# EAGLE board board (EAGLE 6.5.0), part 1 of 2
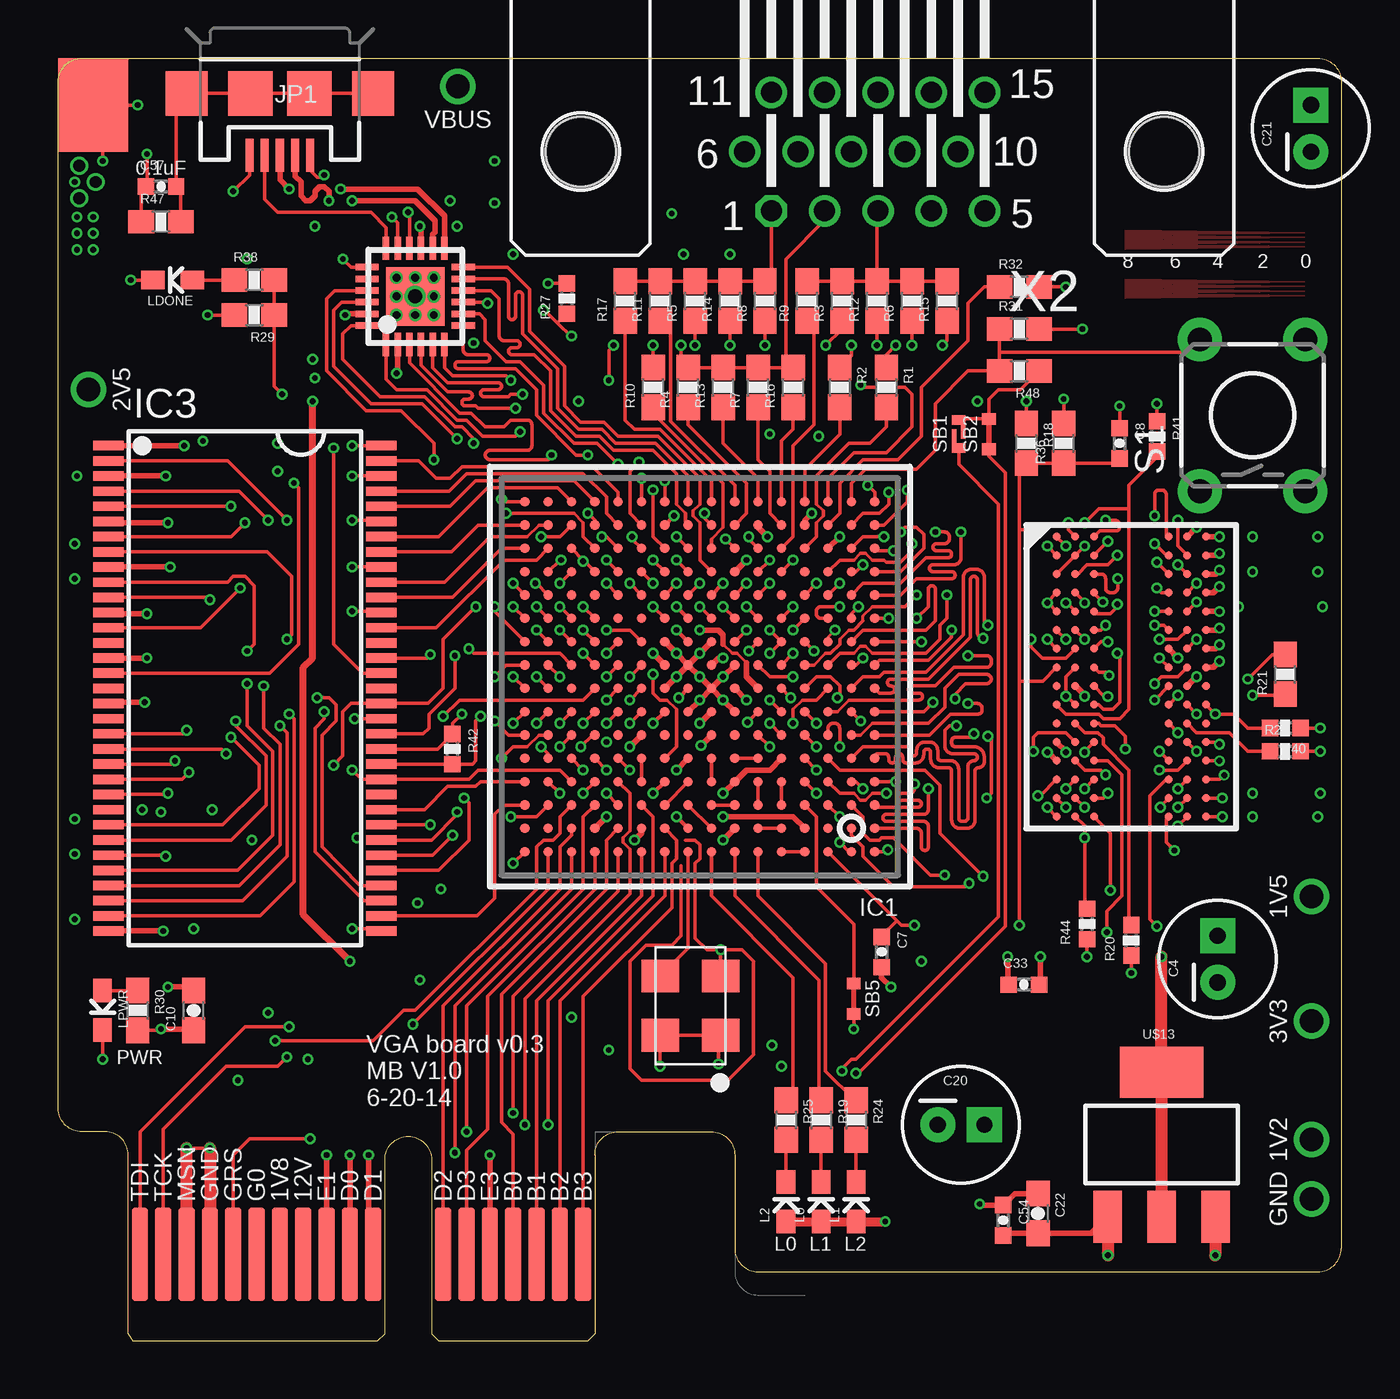
[diagram p2: board, top side]
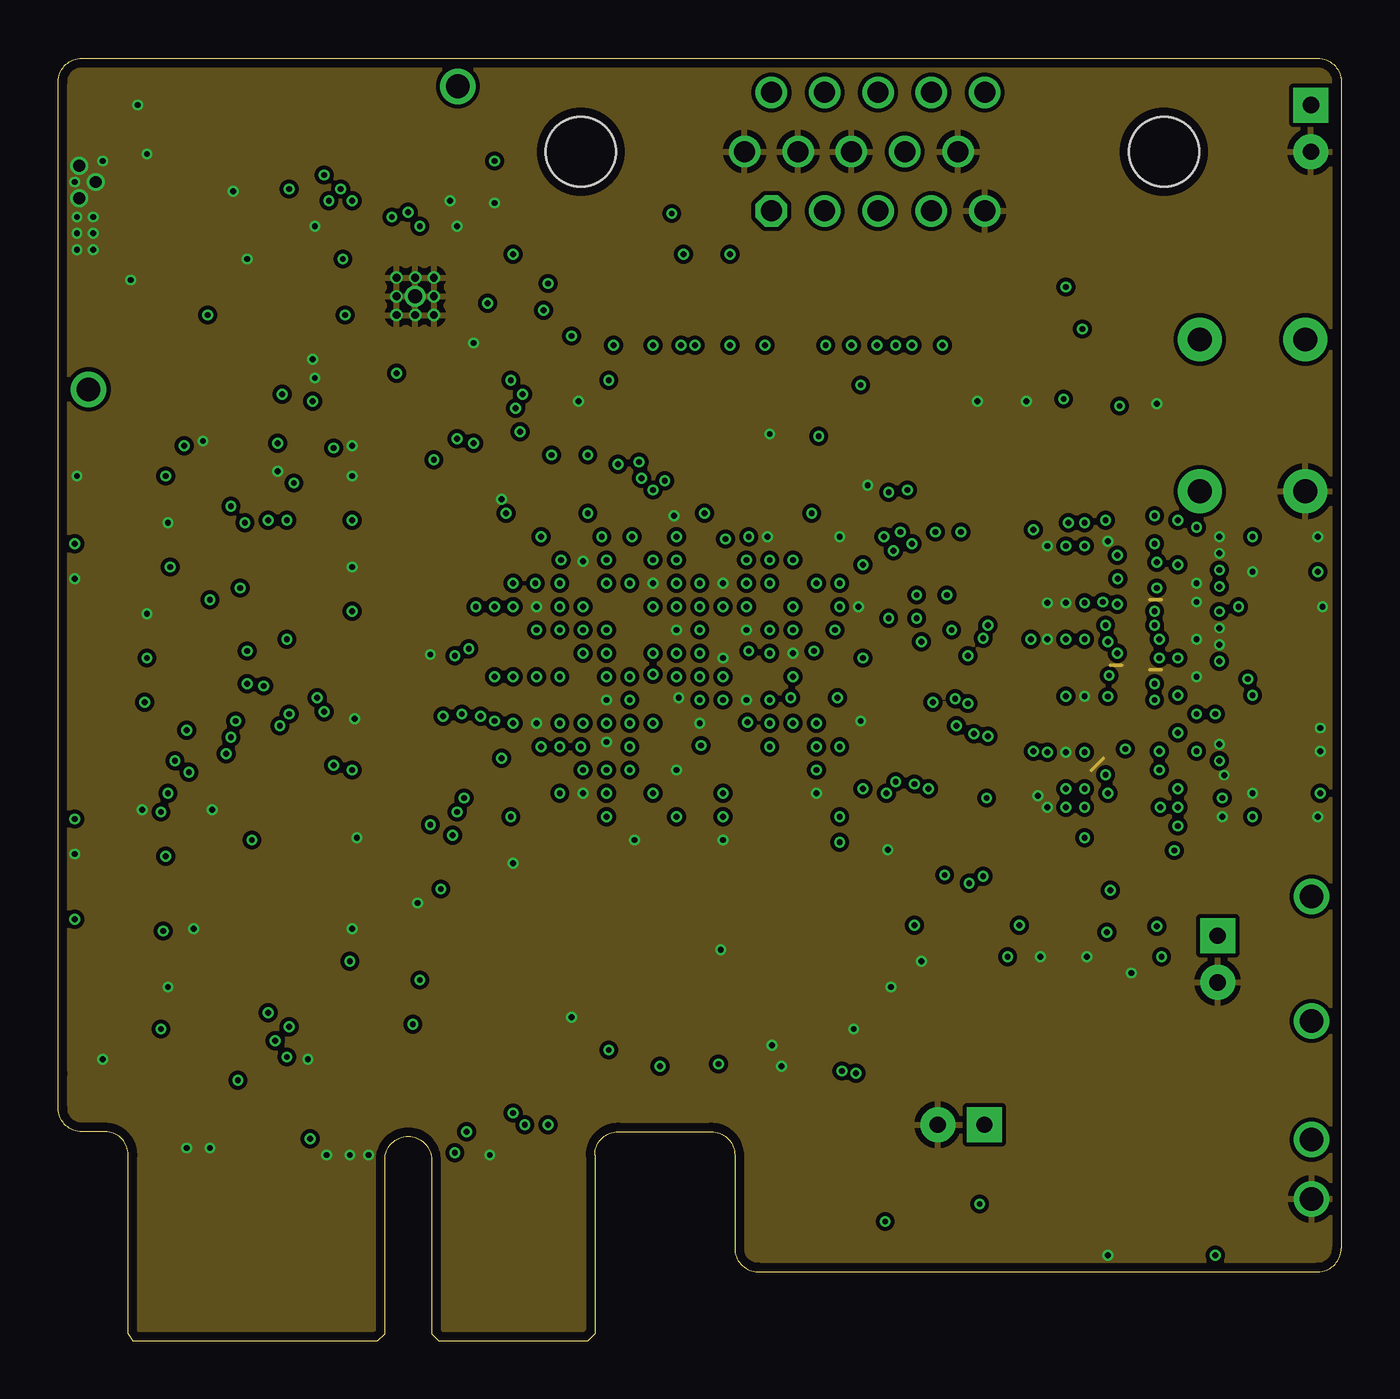
[diagram p3: board, inner layer Route2]
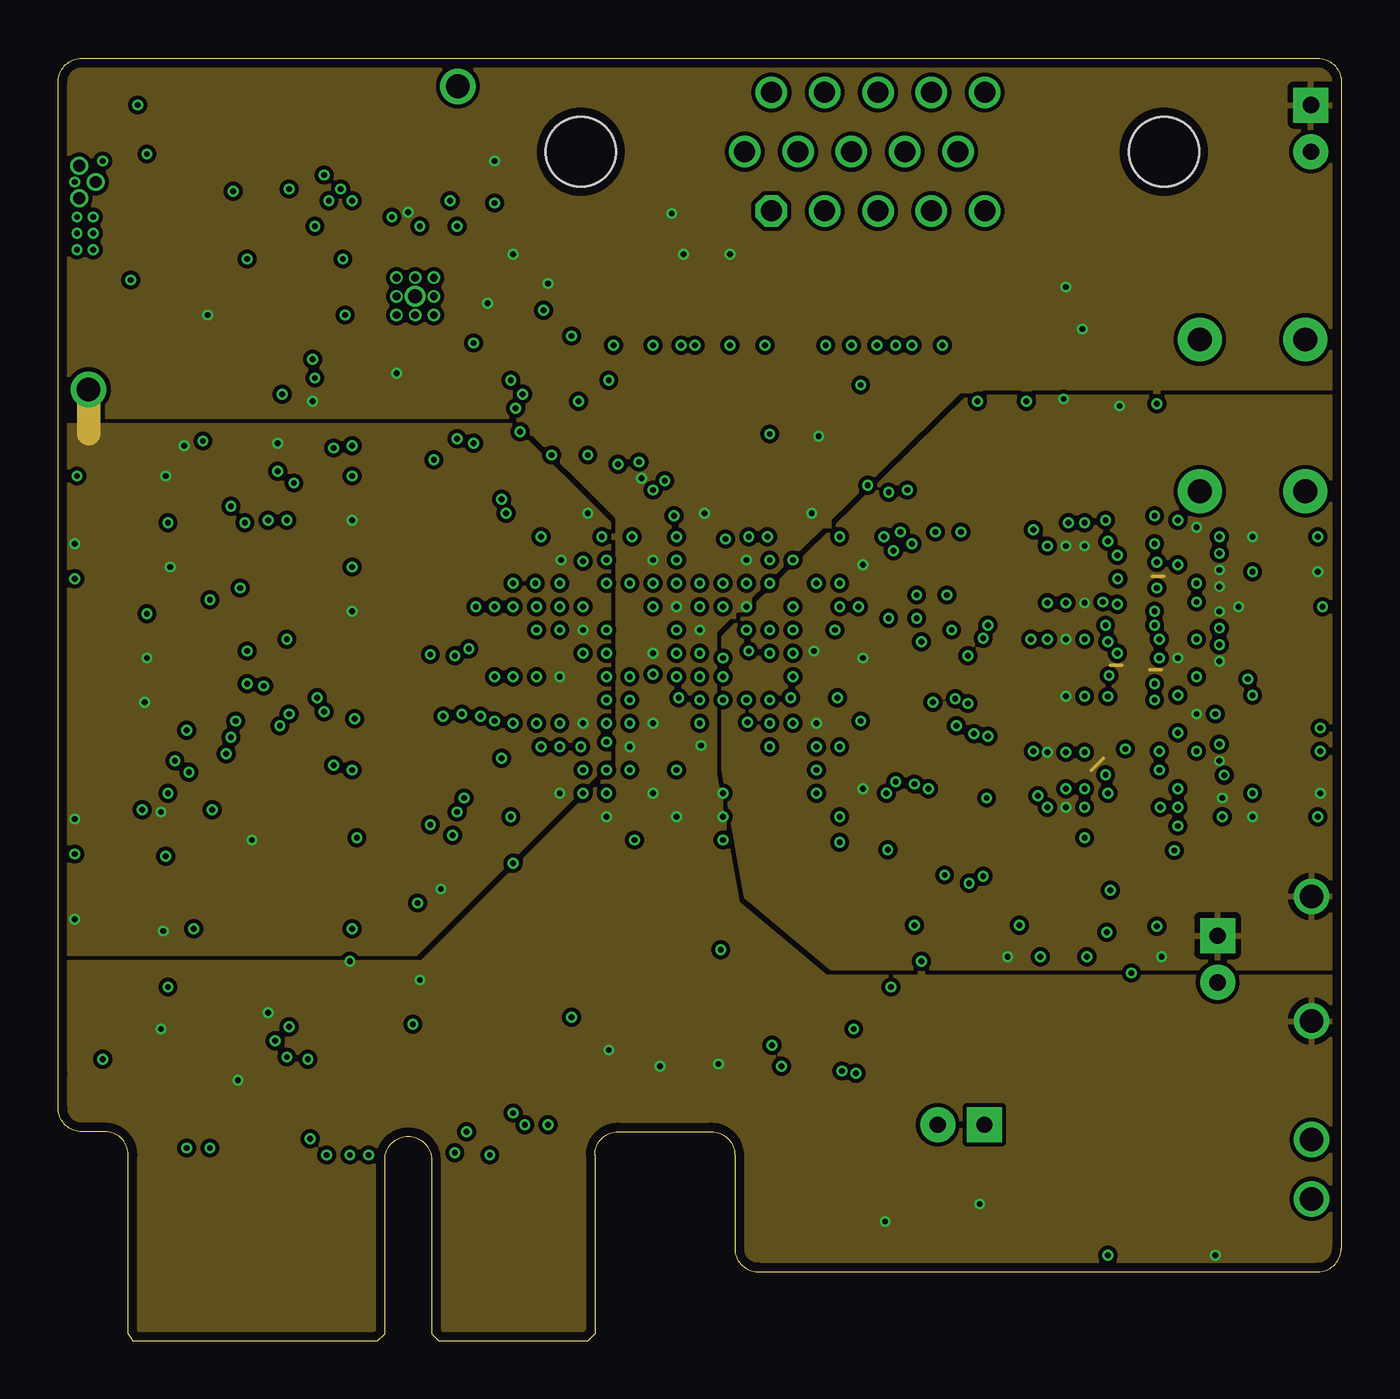
[diagram p4: board, inner layer Route15]
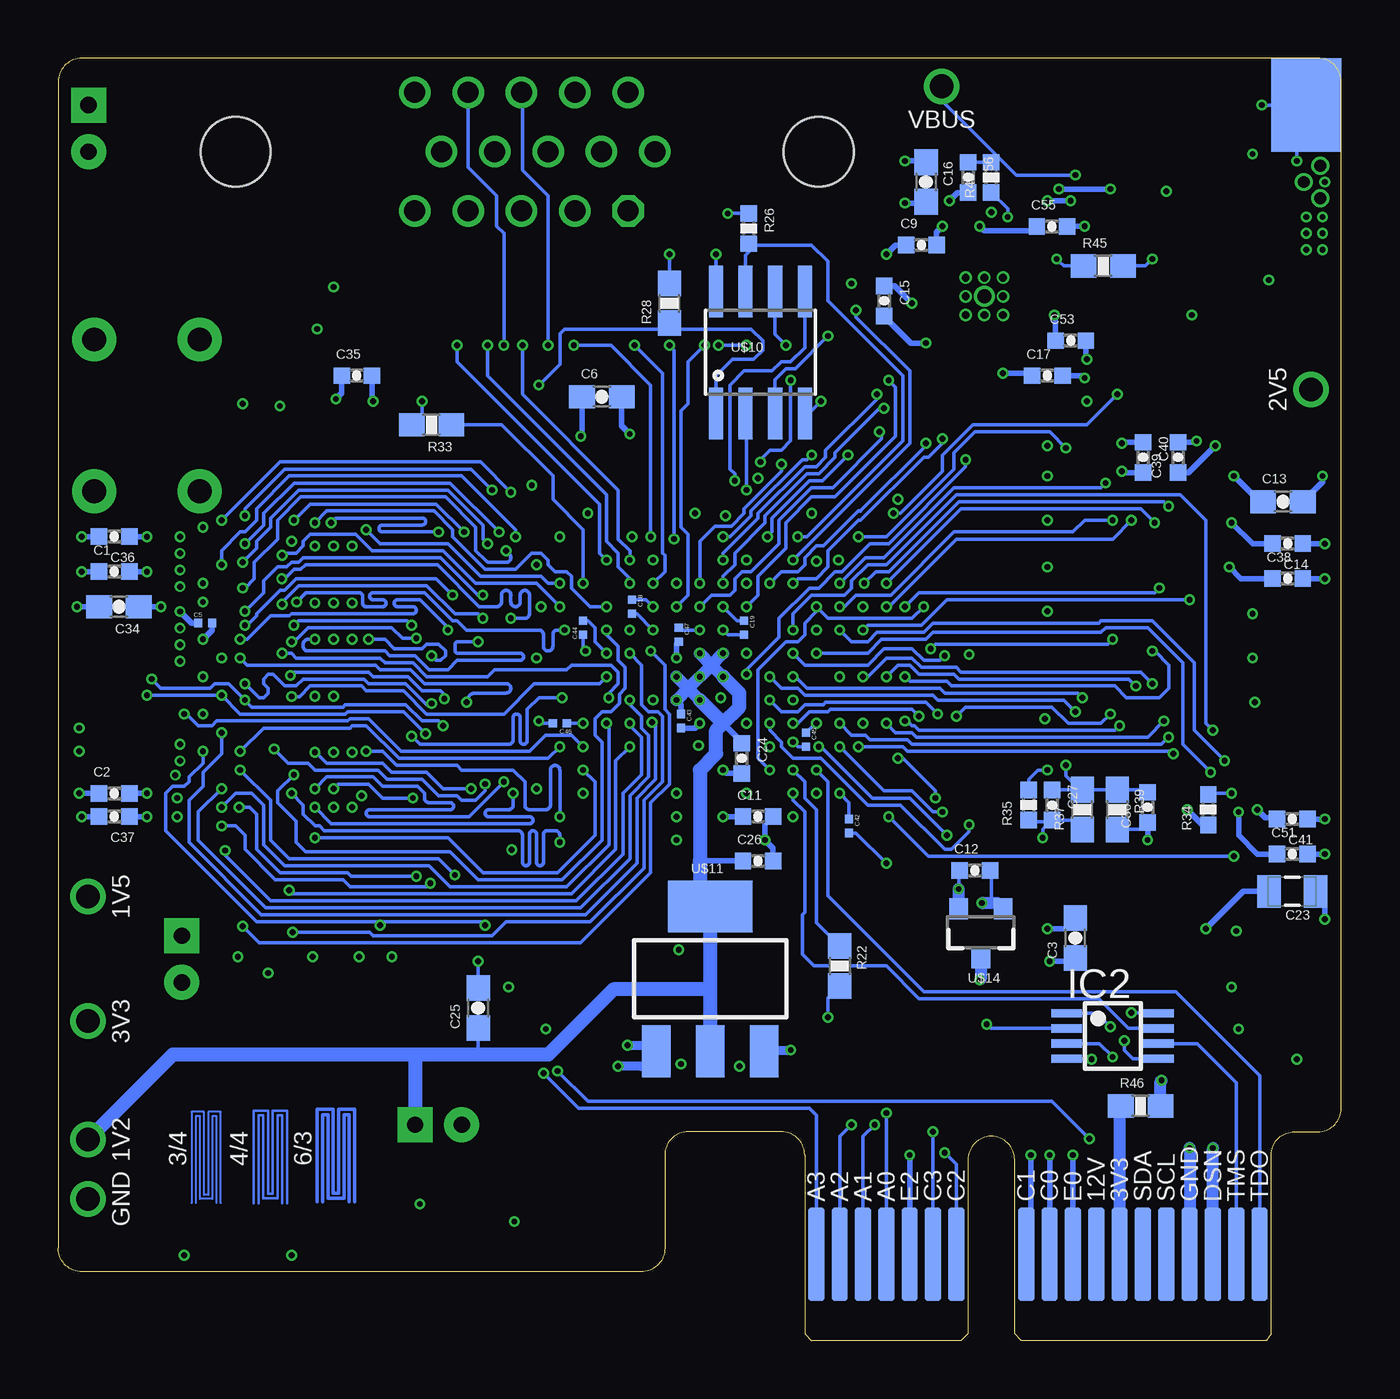
[diagram p5: board, bottom side, seen from below]

Size 55 x 54.95 mm. Coordinates in mm from the lower left corner, seen from the top.
Outline: 0,11.45 0,53.95 arc-90 1,54.95 54,54.95 arc-90 55,53.95 55,3.95 arc-90 54,2.95 30,2.95 arc-90 29,3.95 29,7.95 arc90 28,8.95 24,8.95 arc90 23,7.95
Copper layers (1+2*15+16): Top 0.0356mm / dielectric 0.17mm / Route2 0.0178mm / dielectric 1.1941mm / Route15 0.0178mm / dielectric 0.17mm / Bottom 0.0356mm
Design rules "OSHPark_mine_4layer *": minimum track width 5mil, minimum drill 10mil, track to track 5mil, track to pad 5mil, pad to pad 5mil, via to via 5mil, smd to smd 5mil, copper to edge 15mil, drill to drill 6mil, minimum pad ring 4mil, minimum via ring 4mil, stop-mask expansion 2mil, vias tented up to drill 13mil, thermal gap 10mil

## Footprints (pad centres in the part's own frame; a part is rotated, then mirrored left to right if it is on the bottom)
0402-CAP = smd 0.7 x 0.7: 1 -0.65,0; 2 0.65,0
0603-CAP = smd 1.1 x 1: 1 -0.85,0; 2 0.85,0
CAP-5-2 = drill 0.7 pad 1.5 square: 1 1,0 | drill 0.7 pad 1.5: 2 -1,0
C0201 = smd 0.35 x 0.35: 1 -0.3,0; 2 0.3,0
0805 = smd 1 x 1.4: 1 -1,0; 2 1,0
CLIP-AREA = smd 4 x 3: P$1 0,0 | smd 4 x 3 bottom: P$2 0,0
HOLE_22AWG = drill 1.016: P 0,0
BGA96 = smd 0.35 x 0.35: A1 -3.2,6; A2 -2.4,6; A3 -1.6,6; A7 1.6,6; A8 2.4,6; A9 3.2,6; B1 -3.2,5.2; B2 -2.4,5.2; B3 -1.6,5.2; B7 1.6,5.2; B8 2.4,5.2; B9 3.2,5.2; C1 -3.2,4.4; C2 -2.4,4.4; C3 -1.6,4.4; C7 1.6,4.4; C8 2.4,4.4; C9 3.2,4.4; D1 -3.2,3.6; D2 -2.4,3.6; D3 -1.6,3.6; D7 1.6,3.6; D8 2.4,3.6; D9 3.2,3.6; E1 -3.2,2.8; E2 -2.4,2.8; E3 -1.6,2.8; E7 1.6,2.8; E8 2.4,2.8; E9 3.2,2.8; F1 -3.2,2; F2 -2.4,2; F3 -1.6,2; F7 1.6,2; F8 2.4,2; F9 3.2,2; G1 -3.2,1.2; G2 -2.4,1.2; G3 -1.6,1.2; G7 1.6,1.2; G8 2.4,1.2; G9 3.2,1.2; H1 -3.2,0.4; H2 -2.4,0.4; H3 -1.6,0.4; H7 1.6,0.4; H8 2.4,0.4; H9 3.2,0.4; J1 -3.2,-0.4; J2 -2.4,-0.4; J3 -1.6,-0.4; J7 1.6,-0.4; J8 2.4,-0.4; J9 3.2,-0.4; K1 -3.2,-1.2; K2 -2.4,-1.2; K3 -1.6,-1.2; K7 1.6,-1.2; K8 2.4,-1.2; K9 3.2,-1.2; L1 -3.2,-2; L2 -2.4,-2; L3 -1.6,-2; L7 1.6,-2; L8 2.4,-2; L9 3.2,-2; M1 -3.2,-2.8; M2 -2.4,-2.8; M3 -1.6,-2.8; M7 1.6,-2.8; M8 2.4,-2.8; M9 3.2,-2.8; N1 -3.2,-3.6; N2 -2.4,-3.6; N3 -1.6,-3.6; N7 1.6,-3.6; N8 2.4,-3.6; N9 3.2,-3.6; P1 -3.2,-4.4; P2 -2.4,-4.4; P3 -1.6,-4.4; P7 1.6,-4.4; P8 2.4,-4.4; P9 3.2,-4.4; R1 -3.2,-5.2; R2 -2.4,-5.2; R3 -1.6,-5.2; R7 1.6,-5.2; R8 2.4,-5.2; R9 3.2,-5.2; T1 -3.2,-6; T2 -2.4,-6; T3 -1.6,-6; T7 1.6,-6; T8 2.4,-6; T9 3.2,-6
XILINX_FT256 = smd 0.4 x 0.4: A1 -7.5,7.5; A2 -6.5,7.5; A3 -5.5,7.5; A4 -4.5,7.5; A5 -3.5,7.5; A6 -2.5,7.5; A7 -1.5,7.5; A8 -0.5,7.5; A9 0.5,7.5; A10 1.5,7.5; A11 2.5,7.5; A12 3.5,7.5; A13 4.5,7.5; A14 5.5,7.5; A15 6.5,7.5; A16 7.5,7.5; B1 -7.5,6.5; B2 -6.5,6.5; B3 -5.5,6.5; B4 -4.5,6.5; B5 -3.5,6.5; B6 -2.5,6.5; B7 -1.5,6.5; B8 -0.5,6.5; B9 0.5,6.5; B10 1.5,6.5; B11 2.5,6.5; B12 3.5,6.5; B13 4.5,6.5; B14 5.5,6.5; B15 6.5,6.5; B16 7.5,6.5; C1 -7.5,5.5; C2 -6.5,5.5; C3 -5.5,5.5; C4 -4.5,5.5; C5 -3.5,5.5; C6 -2.5,5.5; C7 -1.5,5.5; C8 -0.5,5.5; C9 0.5,5.5; C10 1.5,5.5; C11 2.5,5.5; C12 3.5,5.5; C13 4.5,5.5; C14 5.5,5.5; C15 6.5,5.5; C16 7.5,5.5; D1 -7.5,4.5; D2 -6.5,4.5; D3 -5.5,4.5; D4 -4.5,4.5; D5 -3.5,4.5; D6 -2.5,4.5; D7 -1.5,4.5; D8 -0.5,4.5; D9 0.5,4.5; D10 1.5,4.5; D11 2.5,4.5; D12 3.5,4.5; D13 4.5,4.5; D14 5.5,4.5; D15 6.5,4.5; D16 7.5,4.5; E1 -7.5,3.5; E2 -6.5,3.5; E3 -5.5,3.5; E4 -4.5,3.5; E5 -3.5,3.5; E6 -2.5,3.5; E7 -1.5,3.5; E8 -0.5,3.5; E9 0.5,3.5; E10 1.5,3.5; E11 2.5,3.5; E12 3.5,3.5; E13 4.5,3.5; E14 5.5,3.5; E15 6.5,3.5; E16 7.5,3.5; F1 -7.5,2.5; F2 -6.5,2.5; F3 -5.5,2.5; F4 -4.5,2.5; F5 -3.5,2.5; F6 -2.5,2.5; F7 -1.5,2.5; F8 -0.5,2.5; F9 0.5,2.5; F10 1.5,2.5; F11 2.5,2.5; F12 3.5,2.5; F13 4.5,2.5; F14 5.5,2.5; F15 6.5,2.5; F16 7.5,2.5; G1 -7.5,1.5; G2 -6.5,1.5; G3 -5.5,1.5; G4 -4.5,1.5; G5 -3.5,1.5; G6 -2.5,1.5; G7 -1.5,1.5; G8 -0.5,1.5; G9 0.5,1.5; G10 1.5,1.5; G11 2.5,1.5; G12 3.5,1.5; G13 4.5,1.5; G14 5.5,1.5; G15 6.5,1.5; G16 7.5,1.5; H1 -7.5,0.5; H2 -6.5,0.5; H3 -5.5,0.5; H4 -4.5,0.5; H5 -3.5,0.5; H6 -2.5,0.5; H7 -1.5,0.5; H8 -0.5,0.5; H9 0.5,0.5; H10 1.5,0.5; H11 2.5,0.5; H12 3.5,0.5; H13 4.5,0.5; H14 5.5,0.5; H15 6.5,0.5; H16 7.5,0.5; J1 -7.5,-0.5; J2 -6.5,-0.5; J3 -5.5,-0.5; J4 -4.5,-0.5; J5 -3.5,-0.5; J6 -2.5,-0.5; J7 -1.5,-0.5; J8 -0.5,-0.5; J9 0.5,-0.5; J10 1.5,-0.5; J11 2.5,-0.5; J12 3.5,-0.5; J13 4.5,-0.5; J14 5.5,-0.5; J15 6.5,-0.5; J16 7.5,-0.5; K1 -7.5,-1.5; K2 -6.5,-1.5; K3 -5.5,-1.5; K4 -4.5,-1.5; K5 -3.5,-1.5; K6 -2.5,-1.5; K7 -1.5,-1.5; K8 -0.5,-1.5; K9 0.5,-1.5; K10 1.5,-1.5; K11 2.5,-1.5; K12 3.5,-1.5; K13 4.5,-1.5; K14 5.5,-1.5; K15 6.5,-1.5; K16 7.5,-1.5; L1 -7.5,-2.5; L2 -6.5,-2.5; L3 -5.5,-2.5; L4 -4.5,-2.5; L5 -3.5,-2.5; L6 -2.5,-2.5; L7 -1.5,-2.5; L8 -0.5,-2.5; L9 0.5,-2.5; L10 1.5,-2.5; L11 2.5,-2.5; L12 3.5,-2.5; L13 4.5,-2.5; L14 5.5,-2.5; L15 6.5,-2.5; L16 7.5,-2.5; M1 -7.5,-3.5; M2 -6.5,-3.5; M3 -5.5,-3.5; M4 -4.5,-3.5; M5 -3.5,-3.5; M6 -2.5,-3.5; M7 -1.5,-3.5; M8 -0.5,-3.5; M9 0.5,-3.5; M10 1.5,-3.5; M11 2.5,-3.5; M12 3.5,-3.5; M13 4.5,-3.5; M14 5.5,-3.5; M15 6.5,-3.5; M16 7.5,-3.5; N1 -7.5,-4.5; N2 -6.5,-4.5; N3 -5.5,-4.5; N4 -4.5,-4.5; N5 -3.5,-4.5; N6 -2.5,-4.5; N7 -1.5,-4.5; N8 -0.5,-4.5; N9 0.5,-4.5; N10 1.5,-4.5; N11 2.5,-4.5; N12 3.5,-4.5; N13 4.5,-4.5; N14 5.5,-4.5; N15 6.5,-4.5; N16 7.5,-4.5; P1 -7.5,-5.5; P2 -6.5,-5.5; P3 -5.5,-5.5; P4 -4.5,-5.5; P5 -3.5,-5.5; P6 -2.5,-5.5; P7 -1.5,-5.5; P8 -0.5,-5.5; P9 0.5,-5.5; P10 1.5,-5.5; P11 2.5,-5.5; P12 3.5,-5.5; P13 4.5,-5.5; P14 5.5,-5.5; P15 6.5,-5.5; P16 7.5,-5.5; R1 -7.5,-6.5; R2 -6.5,-6.5; R3 -5.5,-6.5; R4 -4.5,-6.5; R5 -3.5,-6.5; R6 -2.5,-6.5; R7 -1.5,-6.5; R8 -0.5,-6.5; R9 0.5,-6.5; R10 1.5,-6.5; R11 2.5,-6.5; R12 3.5,-6.5; R13 4.5,-6.5; R14 5.5,-6.5; R15 6.5,-6.5; R16 7.5,-6.5; T1 -7.5,-7.5; T2 -6.5,-7.5; T3 -5.5,-7.5; T4 -4.5,-7.5; T5 -3.5,-7.5; T6 -2.5,-7.5; T7 -1.5,-7.5; T8 -0.5,-7.5; T9 0.5,-7.5; T10 1.5,-7.5; T11 2.5,-7.5; T12 3.5,-7.5; T13 4.5,-7.5; T14 5.5,-7.5; T15 6.5,-7.5; T16 7.5,-7.5
TSSOP8 = smd 1.3 x 0.35: 1 -1.975,0.975; 2 -1.975,0.325; 3 -1.975,-0.325; 4 -1.975,-0.975; 5 1.975,-0.975; 6 1.975,-0.325; 7 1.975,0.325; 8 1.975,0.975
TSOP66-400 = smd 0.4 x 1.3: 1 -10.4,-5.85; 2 -9.75,-5.85; 3 -9.1,-5.85; 4 -8.45,-5.85; 5 -7.8,-5.85; 6 -7.15,-5.85; 7 -6.5,-5.85; 8 -5.85,-5.85; 9 -5.2,-5.85; 10 -4.55,-5.85; 11 -3.9,-5.85; 12 -3.25,-5.85; 13 -2.6,-5.85; 14 -1.95,-5.85; 15 -1.3,-5.85; 16 -0.65,-5.85; 17 0,-5.85; 18 0.65,-5.85; 19 1.3,-5.85; 20 1.95,-5.85; 21 2.6,-5.85; 22 3.25,-5.85; 23 3.9,-5.85; 24 4.55,-5.85; 25 5.2,-5.85; 26 5.85,-5.85; 27 6.5,-5.85; 28 7.15,-5.85; 29 7.8,-5.85; 30 8.45,-5.85; 31 9.1,-5.85; 32 9.75,-5.85; 33 10.4,-5.85; 34 10.4,5.85; 35 9.75,5.85; 36 9.1,5.85; 37 8.45,5.85; 38 7.8,5.85; 39 7.15,5.85; 40 6.5,5.85; 41 5.85,5.85; 42 5.2,5.85; 43 4.55,5.85; 44 3.9,5.85; 45 3.25,5.85; 46 2.6,5.85; 47 1.95,5.85; 48 1.3,5.85; 49 0.65,5.85; 50 0,5.85; 51 -0.65,5.85; 52 -1.3,5.85; 53 -1.95,5.85; 54 -2.6,5.85; 55 -3.25,5.85; 56 -3.9,5.85; 57 -4.55,5.85; 58 -5.2,5.85; 59 -5.85,5.85; 60 -6.5,5.85; 61 -7.15,5.85; 62 -7.8,5.85; 63 -8.45,5.85; 64 -9.1,5.85; 65 -9.75,5.85; 66 -10.4,5.85
USB-MICRO = smd 0.35 x 1.4: D+ 0,2.65; D- -0.65,2.65; GND 1.3,2.65; ID 0.65,2.65; VBUS -1.3,2.65 | smd 1.8 x 1.9: MT1 -4,0; MT2 4,0 | smd 1.9 x 1.9: P$1 -1.27,0; P$2 1.27,0
0603_LED = smd 0.8 x 1.003: A 0,-0.852; C 0,0.852
0603-RES = smd 1.1 x 1: 1 -0.85,0; 2 0.85,0
0402-RES = smd 0.7 x 0.7: 1 -0.65,0; 2 0.65,0
TACTILE-PTH = drill 1.016 pad 1.88: 1 -3.251,2.261; 2 3.251,2.261; 3 -3.251,-2.261; 4 3.251,-2.261
SOLDER-BRIDGE-OPEN = smd 0.4 x 0.6: L1 -0.6,0; R1 0.6,0 | smd 0.6 x 0.2: L2 -0.1,0.2; R2 0.1,-0.2
TRACE-CUT = smd 0.5 x 0.6: L1 -0.65,0; R1 0.65,0
MB-V1-X1-EDGE = smd 0.7 x 4 bottom: A1 -11.5,-0.75; A2 -10.5,-0.75; A3 -9.5,-0.75; A4 -8.5,-0.75; A5 -7.5,-0.75; A6 -6.5,-0.75; A7 -5.5,-0.75; A8 -4.5,-0.75; A9 -3.5,-0.75; A10 -2.5,-0.75; A11 -1.5,-0.75; A12 1.5,-0.75; A13 2.5,-0.75; A14 3.5,-0.75; A15 4.5,-0.75; A16 5.5,-0.75; A17 6.5,-0.75; A18 7.5,-0.75 | smd 0.7 x 4: B1 -11.5,-0.75; B2 -10.5,-0.75; B3 -9.5,-0.75; B4 -8.5,-0.75; B5 -7.5,-0.75; B6 -6.5,-0.75; B7 -5.5,-0.75; B8 -4.5,-0.75; B9 -3.5,-0.75; B10 -2.5,-0.75; B11 -1.5,-0.75; B12 1.5,-0.75; B13 2.5,-0.75; B14 3.5,-0.75; B15 4.5,-0.75; B16 5.5,-0.75; B17 6.5,-0.75; B18 7.5,-0.75
CTS-636 = smd 1.4 x 1.6: 1 -1.27,-1.3; 2 1.27,-1.3; 3 1.27,1.3; 4 -1.27,1.3
SO08 = smd 0.61 x 2.21: 1 -1.905,-2.616; 2 -0.635,-2.616; 3 0.635,-2.616; 4 1.905,-2.616; 5 1.905,2.616; 6 0.635,2.616; 7 -0.635,2.616; 8 -1.905,2.616
SOT223 = smd 1.219 x 2.235: 1 -2.311,-3.099; 2 0,-3.099; 3 2.311,-3.099 | smd 3.6 x 2.2: 4 0,3.099
SOT23-3 = smd 0.8 x 0.9: 1 -0.95,-1; 2 0.95,-1; 3 0,1.1
QFN24 = smd 1 x 0.28: 1 -2.06,1.25; 2 -2.06,0.75; 3 -2.06,0.25; 4 -2.06,-0.25; 5 -2.06,-0.75; 6 -2.06,-1.25; 13 2.06,-1.25; 14 2.06,-0.75; 15 2.06,-0.25; 16 2.06,0.25; 17 2.06,0.75; 18 2.06,1.25 | smd 0.28 x 1: 7 -1.25,-2.06; 8 -0.75,-2.06; 9 -0.25,-2.06; 10 0.25,-2.06; 11 0.75,-2.06; 12 1.25,-2.06; 19 1.25,2.06; 20 0.75,2.06; 21 0.25,2.06; 22 -0.25,2.06; 23 -0.75,2.06; 24 -1.25,2.06 | smd 2.5 x 2.5: 25 0,0 | drill 0.33: 26 -0.8,0.8; 27 0.8,0.8; 28 0.8,-0.8; 29 -0.8,-0.8; 31 0.8,0; 32 0,-0.8; 33 -0.8,0; 34 0,0.8 | drill 0.6: 30 0,0
HDF15H = drill 0.9 octagon: 1 4.329,2.54 | drill 0.9: 2 2.043,2.54; 3 -0.243,2.54; 4 -2.529,2.54; 5 -4.815,2.54; 6 5.472,0; 7 3.186,0; 8 0.9,0; 9 -1.386,0; 10 -3.672,0; 11 4.329,-2.54; 12 2.043,-2.54; 13 -0.243,-2.54; 14 -2.529,-2.54; 15 -4.815,-2.54 | hole 3: -12.5,0; 12.5,0

## Placement (x,y rotation side)
C1  1uF  [0402-CAP]  52.6,32.95 0 bottom
C2  1uF  [0402-CAP]  52.6,23.45 0 bottom
C3  10uF  [0603-CAP]  11.4,17.25 90 bottom
C4  100uF  [CAP-5-2]  49.7,16.35 90 top
C5  0.1uF  [C0201]  48.7,30.75 0 bottom
C6  10uF  [0603-CAP]  31.7,40.45 0 bottom
C7  1uF  [0402-CAP]  35.3,16.65 270 top
C8  1uF  [0402-CAP]  45.5,38.45 270 top
C9  1uF  [0402-CAP]  18,46.95 0 bottom
C10  10uF  [0603-CAP]  5.8,14.15 90 top
C11  1uF  [0402-CAP]  25,22.45 0 bottom
C12  1uF  [0402-CAP]  15.7,20.15 0 bottom
C13  10uF  [0603-CAP]  2.5,35.95 0 bottom
C14  1uF  [0402-CAP]  2.3,34.15 180 bottom
C15  1uF  [0402-CAP]  19.6,44.55 270 bottom
C16  10uF  [0603-CAP]  17.8,49.65 270 bottom
C17  1uF  [0402-CAP]  12.6,41.35 0 bottom
C18  0.1uF  [C0201]  30.4,31.45 270 bottom
C19  0.1uF  [C0201]  25.6,30.55 270 bottom
C20  100uF  [CAP-5-2]  38.7,9.25 0 top
C21  100uF  [CAP-5-2]  53.7,51.95 90 top
C22  10uF  [0603-CAP]  42,5.45 270 top
C23  22uF  [0805]  2.1,19.25 180 bottom
C24  1uF  [0402-CAP]  25.7,24.95 270 bottom
C25  10uF  [0603-CAP]  37,14.25 90 bottom
C26  1uF  [0402-CAP]  25,20.55 0 bottom
C27  1uF  [0402-CAP]  12.4,22.95 270 bottom
C30  1uF  [0402-CAP]  8.3,22.85 90 bottom
C33  1uF  [0402-CAP]  41.4,15.25 0 top
C34  10uF  [0603-CAP]  52.4,31.45 180 bottom
C35  1uF  [0402-CAP]  42.2,41.35 0 bottom
C36  1uF  [0402-CAP]  52.6,34.45 180 bottom
C37  1uF  [0402-CAP]  52.6,22.45 180 bottom
C38  1uF  [0402-CAP]  2.3,32.65 0 bottom
C39  1uF  [0402-CAP]  7,37.85 90 bottom
C40  1uF  [0402-CAP]  8.5,37.85 270 bottom
C41  1uF  [0402-CAP]  2.1,22.35 180 bottom
C42  0.1uF  [C0201]  21.1,22.05 270 bottom
C43  0.1uF  [C0201]  28.3,26.55 270 bottom
C44  0.1uF  [C0201]  32.5,30.55 90 bottom
C45  0.1uF  [C0201]  22.95,25.75 270 bottom
C46  0.1uF  [C0201]  33.5,26.45 180 bottom
C47  0.1uF  [C0201]  28.4,30.25 270 bottom
C51  1uF  [0402-CAP]  2.1,20.85 0 bottom
C53  1uF  [0402-CAP]  11.6,42.85 0 bottom
C54  1uF  [0402-CAP]  40.5,5.15 270 top
C55  1uF  [0402-CAP]  12.4,47.75 0 bottom
C56  1uF  [0402-CAP]  16,49.85 270 bottom
C57  0.1uF  [0402-CAP]  4.4,49.45 0 top
CLIP  GND  [CLIP-AREA]  1.5,52.95 270 bottom
CONN1  3V3  [HOLE_22AWG]  53.73,13.69 270 top
CONN2  2V5  [HOLE_22AWG]  1.3,40.76 90 top
CONN3  1V2  [HOLE_22AWG]  53.73,8.61 270 top
CONN4  GND  [HOLE_22AWG]  53.73,6.07 270 top
CONN5  1V5  [HOLE_22AWG]  53.73,19.03 270 top
CONN7  VBUS  [HOLE_22AWG]  17.13,53.75 0 top
DDR3_0  W631GG6KB  [BGA96]  46,28.45 0 top
IC1  XC6S{9,16,25}LX-FT256  [XILINX_FT256]  27.5,28.45 180 top
IC2  74LVC3G34  [TSSOP8]  9.8,13.05 0 bottom
IC3  AS4C8M16D1  [TSOP66-400]  8,27.95 270 top
JP1  USBMICRO  [USB-MICRO]  9.5,53.45 180 top
L0  BLU  [0603_LED]  32.7,5.95 0 top
L1  GRN  [0603_LED]  34.2,5.95 0 top
L2  RED  [0603_LED]  31.2,5.95 0 top
LDONE  GRN  [0603_LED]  4.9,45.45 90 top
LPWR  GRN  [0603_LED]  1.9,14.15 180 top
R1  100  [0603-RES]  35.5,40.85 270 top
R2  100  [0603-RES]  33.5,40.85 270 top
R3  4.02k  [0603-RES]  33.6,44.55 90 top
R4  4.02k  [0603-RES]  27,40.85 90 top
R5  2k  [0603-RES]  27.3,44.55 90 top
R6  1k  [0603-RES]  36.6,44.55 90 top
R7  1k  [0603-RES]  30,40.85 90 top
R8  499  [0603-RES]  30.3,44.55 90 top
R9  8.06k  [0603-RES]  32.1,44.55 90 top
R10  8.06k  [0603-RES]  25.5,40.85 90 top
R11  4.02k  [0603-RES]  25.8,44.55 90 top
R12  2k  [0603-RES]  35.1,44.55 90 top
R13  2k  [0603-RES]  28.5,40.85 90 top
R14  1k  [0603-RES]  28.8,44.55 90 top
R15  499  [0603-RES]  38.1,44.55 90 top
R16  499  [0603-RES]  31.5,40.85 90 top
R17  8.06k  [0603-RES]  24.3,44.55 90 top
R18  10k  [0603-RES]  41.5,38.45 270 top
R19  680  [0603-RES]  32.7,9.45 270 top
R20  4.7k  [0402-RES]  46,17.15 90 top
R21  100  [0603-RES]  52.6,28.55 90 top
R22  100  [0603-RES]  21.5,16.05 270 bottom
R23  240 1%  [0402-RES]  52.6,25.25 0 top
R24  330  [0603-RES]  34.2,9.45 270 top
R25  680  [0603-RES]  31.2,9.45 270 top
R26  10k  [0402-RES]  25.4,47.65 270 bottom
R27  DNP(10k)  [0402-RES]  21.8,44.65 90 top
R28  10k  [0603-RES]  28.8,44.45 90 bottom
R29  220  [0603-RES]  8.4,43.95 180 top
R30  330  [0603-RES]  3.4,14.15 270 top
R31  4.7k  [0603-RES]  41.2,43.35 0 top
R32  4.7k  [0603-RES]  41.2,45.15 0 top
R33  100  [0603-RES]  39,39.25 180 bottom
R34  4.7k  [0402-RES]  5.7,22.75 90 bottom
R35  4.7k  [0402-RES]  13.4,22.95 90 bottom
R36  10k  [0603-RES]  43.1,38.45 90 top
R37  10k  [0603-RES]  11.1,22.75 90 bottom
R38  220  [0603-RES]  8.4,45.45 0 top
R39  10k  [0603-RES]  9.6,22.75 270 bottom
R40  4.7k  [0402-RES]  52.6,26.25 180 top
R41  4.7k  [0402-RES]  47.1,38.75 270 top
R42  100  [0402-RES]  16.9,25.35 270 top
R43  20k  [0402-RES]  15,49.85 90 bottom
R44  4.7k  [0402-RES]  44.1,17.85 90 top
R45  8.06k 1%  [0603-RES]  10.2,46.05 0 bottom
R46  0.01R  [0603-RES]  8.6,10.05 0 bottom
R47  330  [0603-RES]  4.4,47.95 0 top
R48  100  [0603-RES]  41.2,41.55 180 top
S1  TAC_SWITCHPTH  [TACTILE-PTH]  51.2,39.65 90 top
SB1  SOLDER-BRIDGEOPEN  [SOLDER-BRIDGE-OPEN]  38.6,38.85 90 top
SB2  TRACE-CUT  [TRACE-CUT]  39.9,38.85 90 top
SB5  TRACE-CUT  [TRACE-CUT]  34.1,14.65 270 top
U$3  MB-V1-X1EDGE_SILK  [MB-V1-X1-EDGE]  15,4.45 0 top
U$6  OSCILLATORCTS-636-50MHz  [CTS-636]  27.1,14.35 90 top
U$10  M25P80/W25Q80  [SO08]  24.9,42.35 0 bottom
U$11  LD1117S12  [SOT223]  27.05,15.5 0 bottom
U$13  NCP1117ST15  [SOT223]  47.3,8.4 0 top
U$14  MCP1700T-2502  [SOT23-3]  15.45,17.5 180 bottom
U$20  USB3343  [QFN24]  15.3,44.75 90 top
X2  [HDF15H]  34.9,50.95 180 top